# Altium schematic sheet Converter2.SchDoc
size Tabloid
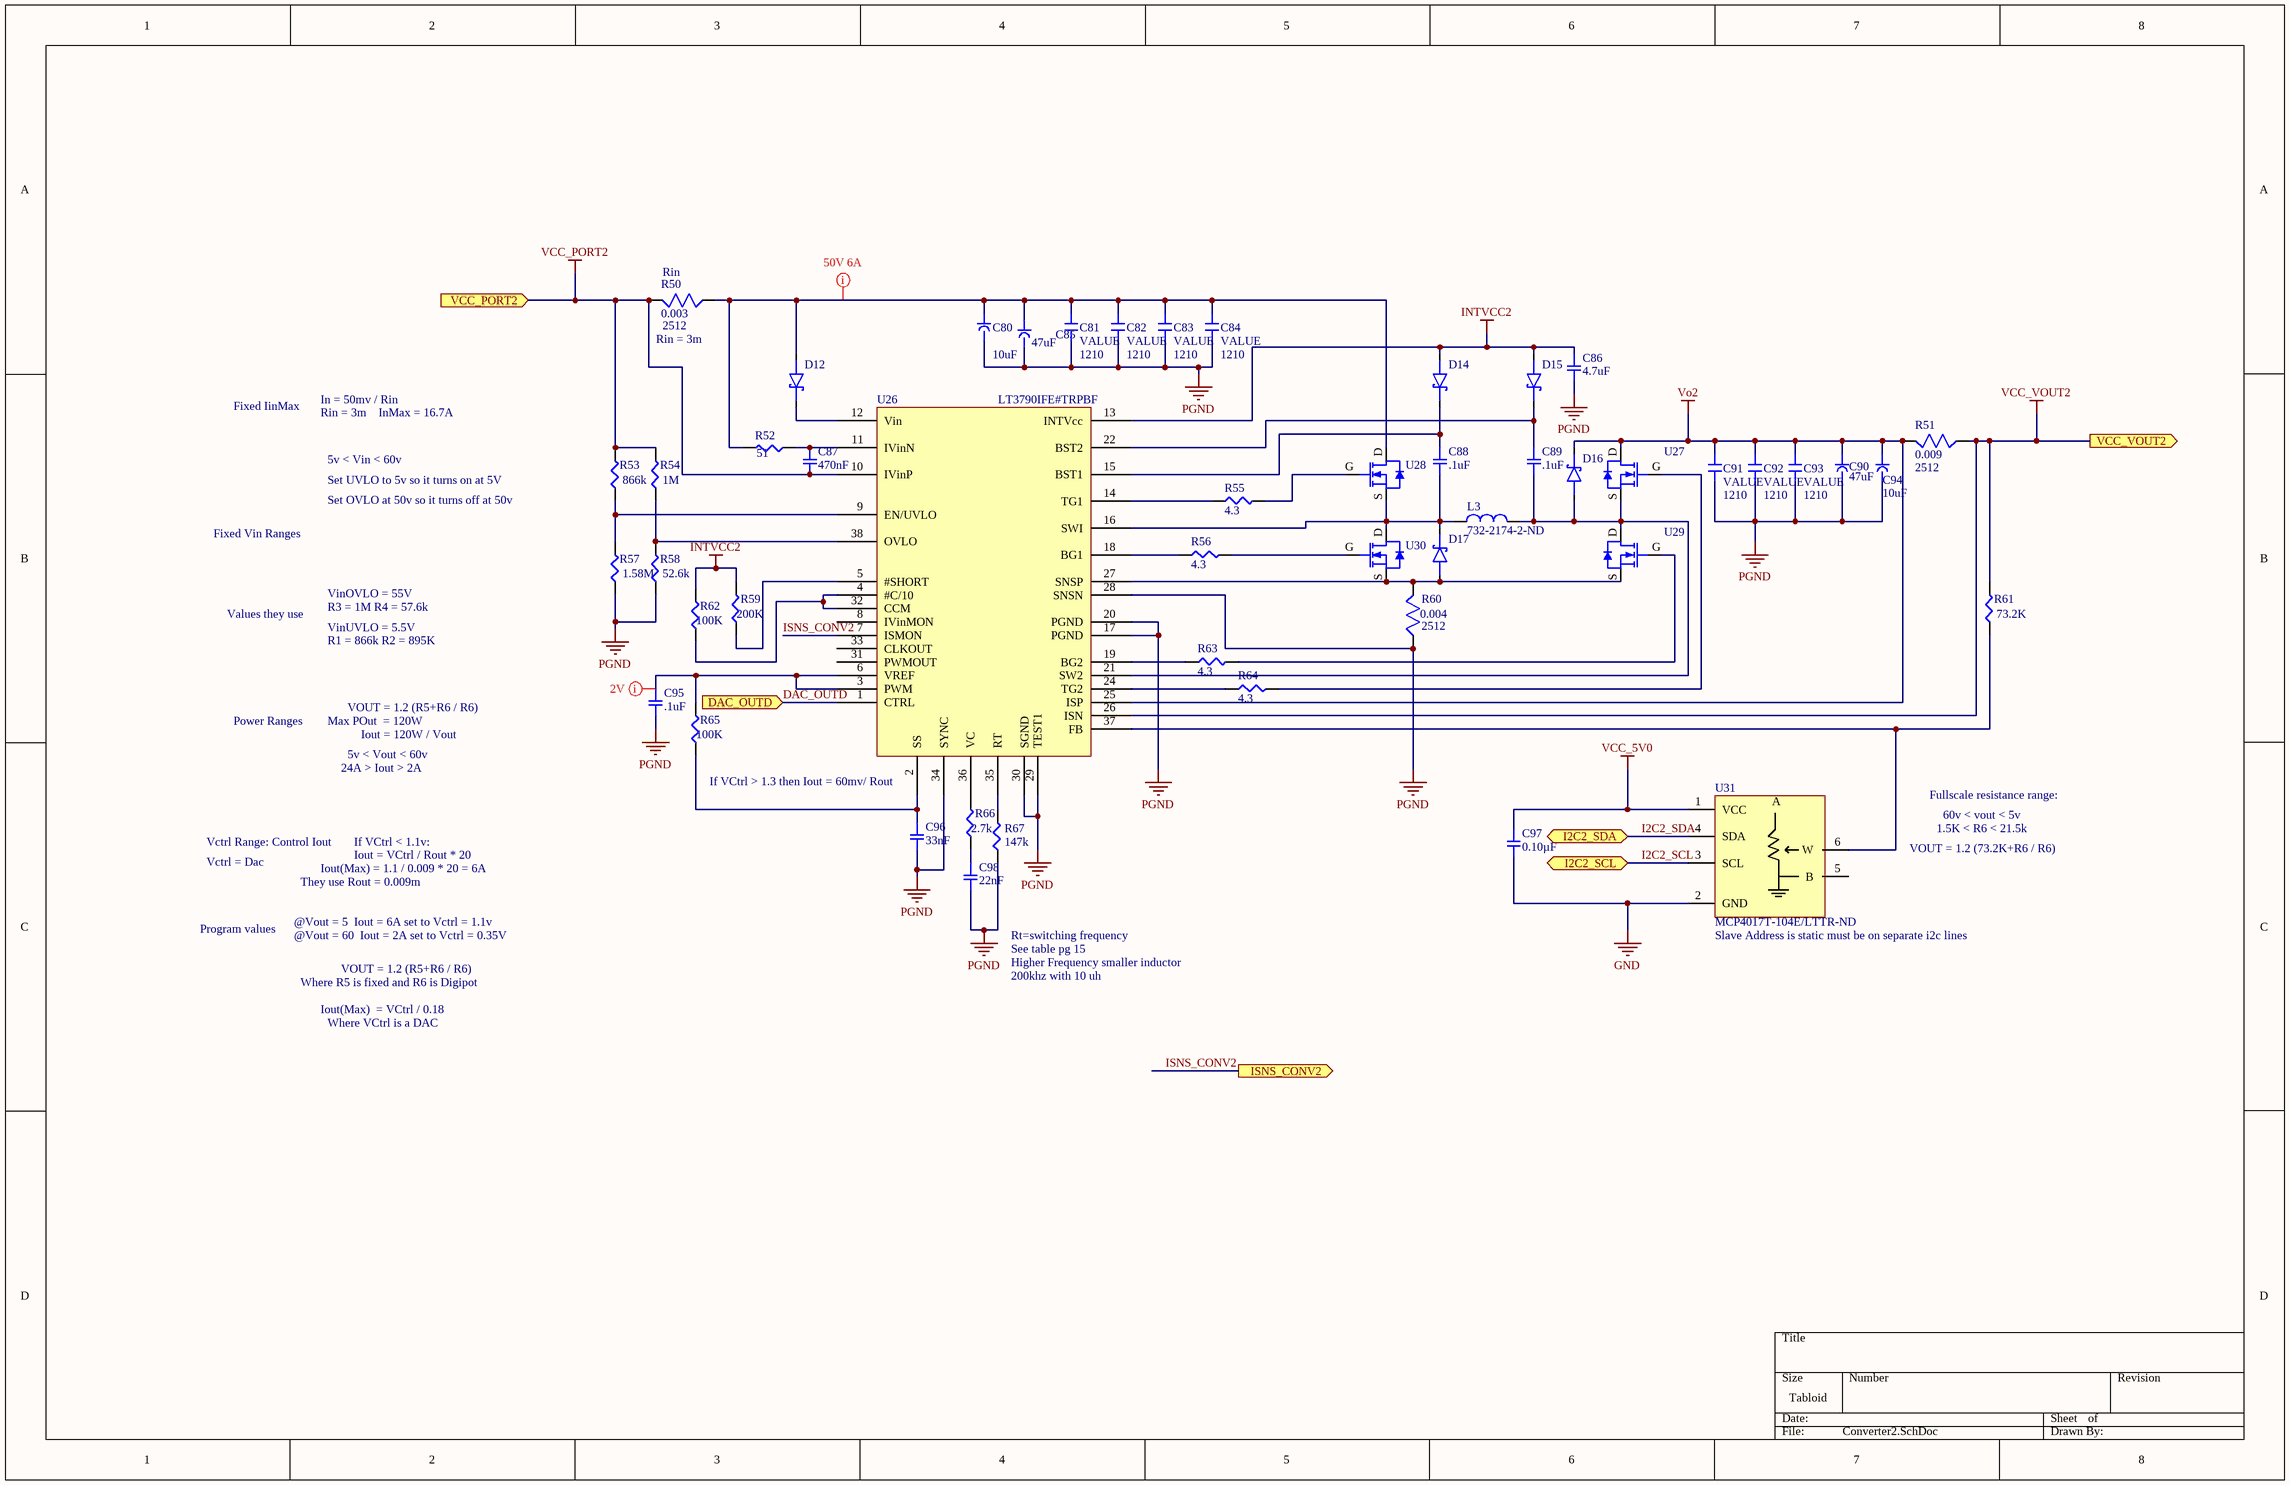
[diagram p0: Converter2.SchDoc]

## Parts
C80  value 10uF  [panasonic d8]  (hidden comment: EEE-FN1K100XL)
C81  VALUE  Size: 1210  [1210 cap]
C82  VALUE  Size: 1210  [1210 cap]
C83  VALUE  Size: 1210  [1210 cap]
C84  VALUE  Size: 1210  [1210 cap]
C85  10-EEE-FN1K470UVTR-ND  [EEE-FN1K470UV]  (value not drawn)
C86  4.7uF  [SMD-0603C]
C87  470nF  [SMD-0603C]
C88  .1uF  [SMD-0603C]
C89  .1uF  [SMD-0603C]
C90  10-EEE-FN1K470UVTR-ND  [EEE-FN1K470UV]  (value not drawn)
C91  VALUE  Size: 1210  [1210 cap]
C92  VALUE  Size: 1210  [1210 cap]
C93  VALUE  Size: 1210  [1210 cap]
C94  value 10uF  [panasonic d8]  (hidden comment: EEE-FN1K100XL)
C95  .1uF  [SMD-0603C]
C96  33nF  [SMD-0603C]
C97  0.10µF  [SMD-0603C]
C98  22nF  [SMD-0603C]
D12  SK58L-TPMSTR-ND  [SMC(DO-214AB)]  (value not drawn)
D14  BAT46WJ,115  [SOD323F]  (value not drawn)
D15  BAT46WJ,115  [SOD323F]  (value not drawn)
D16  SK58L-TPMSTR-ND  [SMC(DO-214AB)]  (value not drawn)
D17  SK58L-TPMSTR-ND  [SMC(DO-214AB)]  (value not drawn)
L3  732-2174-2-ND  [Inductor]
R50  0.003  [2512]
R51  0.009  [2512]
R52  51  [SMD-0603-RES]
R53  866k  [SMD-0603-RES]
R54  1M  [SMD-0603-RES]
R55  4.3  [SMD-0603-RES]
R56  4.3  [SMD-0603-RES]
R57  1.58M  [SMD-0603-RES]
R58  52.6k  [SMD-0603-RES]
R59  200K  [SMD-0603-RES]
R60  0.004  [2512]
R61  73.2K  [SMD-0603-RES]
R62  100K  [SMD-0603-RES]
R63  4.3  [SMD-0603-RES]
R64  4.3  [SMD-0603-RES]
R65  100K  [SMD-0603-RES]
R66  2.7k  [SMD-0603-RES]
R67  147k  [SMD-0603-RES]
U26  LT3790IFE#TRPBF  [TSSOP-38-GNDPAD]
U27  SQJA80EP-T1_GE3TR-ND  [PowerPAK® SO-8L SINGLE]  (value not drawn)
U28  SQJA80EP-T1_GE3TR-ND  [PowerPAK® SO-8L SINGLE]  (value not drawn)
U29  SQJA80EP-T1_GE3TR-ND  [PowerPAK® SO-8L SINGLE]  (value not drawn)
U30  SQJA80EP-T1_GE3TR-ND  [PowerPAK® SO-8L SINGLE]  (value not drawn)
U31  MCP4017T-104E/LTTR-ND  [SC70]

## Ports
DAC_OUTD (in), I2C2_SCL (bidir), I2C2_SDA (bidir), ISNS_CONV2 (out), VCC_PORT2 (in), VCC_VOUT2 (out)

## Nets
GND: C97.2 U31.2(GND)
INTVCC2: C86.1 D14.2 D15.2 R59.2 R62.2 U26.13(INTVcc)
PGND: C80.2 C81.2 C82.2 C83.2 C84.2 C85.1 C86.2 C90.1 C91.2 C92.2 C93.2 C94.2 C95.2 C96.2 C98.2 R57.1 R58.1 R60.1 R67.1 U26.17(PGND) U26.20(PGND) U26.28(SNSN) U26.29(TEST1) U26.30(SGND) U26.34(SYNC)
VCC_5V0: C97.1 U31.1(VCC)
VCC_PORT2: C87.2 R50.2 R53.2 R54.2 U26.10(IVinP) ; port VCC_PORT2
VCC_VOUT2: R51.1 R61.2 U26.26(ISN) ; port VCC_VOUT2
Vo2: C90.2 C91.1 C92.1 C93.1 C94.1 D16.1 R51.2 U26.25(ISP) U27.D(DRAIN)
DAC_OUTD: U26.1(CTRL) ; port DAC_OUTD
I2C2_SCL: U31.3(SCL) ; port I2C2_SCL
I2C2_SDA: U31.4(SDA) ; port I2C2_SDA
ISNS_CONV2: U26.7(ISMON) ; port ISNS_CONV2
NetC80_1: C80.1 C81.1 C82.1 C83.1 C84.1 C85.2 D12.2 R50.1 R52.2 U28.D(DRAIN)
NetC87_1: C87.1 R52.1 U26.11(IVinN)
NetC88_1: C88.1 D14.1 U26.15(BST1)
NetC88_2: C88.2 D17.1 L3.1 U26.16(SWI) U28.S(SOURCE) U30.D(DRAIN)
NetC89_1: C89.1 D15.1 U26.22(BST2)
NetC89_2: C89.2 D16.2 L3.2 U26.21(SW2) U27.S(SOURCE) U29.D(DRAIN)
NetC95_1: C95.1 R65.2 U26.3(PWM) U26.6(VREF)
NetC96_1: C96.1 R65.1 U26.2(SS)
NetC98_1: C98.1 R66.1
NetD12_1: D12.1 U26.12(Vin)
NetD17_2: D17.2 R60.2 U26.27(SNSP) U29.S(SOURCE) U30.S(SOURCE)
NetR53_1: R53.1 R57.2 U26.9(EN/UVLO)
NetR54_1: R54.1 R58.2 U26.38(OVLO)
NetR55_1: R55.1 U26.14(TG1)
NetR55_2: R55.2 U28.G(GATE)
NetR56_1: R56.1 U26.18(BG1)
NetR56_2: R56.2 U30.G(GATE)
NetR59_1: R59.1 U26.5(#SHORT)
NetR61_1: R61.1 U26.37(FB) U31.6(W)
NetR62_1: R62.1 U26.4(#C/10) U26.32(CCM)
NetR63_1: R63.1 U26.19(BG2)
NetR63_2: R63.2 U29.G(GATE)
NetR64_1: R64.1 U26.24(TG2)
NetR64_2: R64.2 U27.G(GATE)
NetR66_2: R66.2 U26.36(VC)
NetR67_2: R67.2 U26.35(RT)

Not connected (* = marked no-connect by the designer): U26 8(IVinMON) 31(PWMOUT) 33(CLKOUT); U31 5(B)

## Layout directives
mark named 2V: NetC95_1
mark named 50V 6A: NetC80_1

## Notes on the sheet
- (near R50) Rin
- (near R50) Rin = 3m
- Fixed IinMax
- Rin = 3m    InMax = 16.7A
- In = 50mv / Rin
- Set UVLO to 5v so it turns on at 5V
- 5v < Vin < 60v
- Fixed Vin Ranges
- Set OVLO at 50v so it turns off at 50v
- Values they use
- VinOVLO = 55V
- R3 = 1M R4 = 57.6k
- VinUVLO = 5.5V
- R1 = 866k R2 = 895K
- Power Ranges
- Max POut  = 120W
- 5v < Vout < 60v
- VOUT = 1.2 (R5+R6 / R6)
- Iout = 120W / Vout
- 24A > Iout > 2A
- If VCtrl > 1.3 then Iout = 60mv/ Rout
- Fullscale resistance range:
- 1.5K < R6 < 21.5k
- 60v < vout < 5v
- Vctrl Range: Control Iout
- Vctrl = Dac
- They use Rout = 0.009m
- Iout(Max) = 1.1 / 0.009 * 20 = 6A
- If VCtrl < 1.1v:
- Iout = VCtrl / Rout * 20
- VOUT = 1.2 (73.2K+R6 / R6)
- Program values
- @Vout = 5  Iout = 6A set to Vctrl = 1.1v
- @Vout = 60  Iout = 2A set to Vctrl = 0.35V
- Rt=switching frequency
- See table pg 15
- Higher Frequency smaller inductor
- (near U31) Slave Address is static must be on separate i2c lines
- Where R5 is fixed and R6 is Digipot
- Iout(Max)  = VCtrl / 0.18
- Where VCtrl is a DAC
- 200khz with 10 uh
- (in symbol CAP ALUM 47UF) 47uF
- (in symbol IC DIGIPOT MCP4017T-104E/LT) A

## Library data of the parts
C80 C94 = CAP ALUM 10UF: CAP ALUM 10UF 20% 80V SMD
C81-C84 C91-C93 = CAP SMD 1210
C85 C90 = CAP ALUM 47UF: CAP ALUM 47UF 20% 80V SMD
C86-C89 C95 C96 C98 = GCJ188R71H472KA01D: 0603; Manufacturer: Murata Electronics North America; Factory Stock: 0; Unit Price (USD): 0.19; Minimum Quantity: 1; Value: 4700pF; Tolerance: ±10%; Voltage: 50V; Temperature Coefficient: X7R; Datasheets: http://www.murata.com/~/media/webrenewal/support/library/catalog/products/capacitor/mlcc/c03e.ashx; Image: //media.digikey.com/Renders/Murata%20Renders/0603%28LQG18%29.jpg; Digi-Key Part Number: 490-5764-1-ND; Part Number: GCJ188R71H472KA01D; Quantity Available: 7743; @ qty: 0; Packaging: Cut Tape (CT); Series: GCJ; Part Status: Active; Operating Temperature: -55°C ~ 125°C; Features: Soft Termination; Ratings: AEC-Q200; Applications: Automotive, Boardflex Sensitive; Mounting Type: Surface Mount, MLCC; Package / Case: 0603 (1608 Metric); Size / Dimension: 0.063" L x 0.031" W (1.60mm x 0.80mm); Height - Seated (Max): -; Thickness (Max): 0.031" (0.80mm); Lead Spacing: -; Lead Style: -
C97 = GCJ188R71H104KA12D: CAP CER 0.1UF 50V X7R 0603; Manufacturer: Murata Electronics North America; Factory Stock: 0; Unit Price (USD): 0.12; Minimum Quantity: 1; Tolerance: ±10%; Datasheets: http://www.murata.com/~/media/webrenewal/support/library/catalog/products/capacitor/mlcc/c03e.ashx; Image: //media.digikey.com/Renders/Murata%20Renders/0603%28LQG18%29.jpg; Digi-Key Part Number: 490-5798-1-ND; Part Number: GCJ188R71H104KA12D; Quantity Available: 163695; @ qty: 0; Packaging: Cut Tape (CT); Series: GCJ; Part Status: Active; Value: 0.10µF; Voltage: 50V; Temperature Coefficient: X7R; Operating Temperature: -55°C ~ 125°C; Features: Soft Termination; Ratings: AEC-Q200; Applications: Automotive, Boardflex Sensitive; Mounting Type: Surface Mount, MLCC; Package / Case: 0603 (1608 Metric); Size / Dimension: 0.063" L x 0.031" W (1.60mm x 0.80mm); Height - Seated (Max): -; Thickness (Max): 0.035" (0.90mm); Lead Spacing: -; Lead Style: -
D12 D16 D17 = DIODE SK58L-TP: DIODE SCHOTTKY 80V 5A DO214AB/SMC / Diode Schottky 80 V 5A Surface Mount SMC (DO-214AB)
D14 D15 = BAT46WJ,115: DIODE SCHOTTKY 100V 250MA SOD323 / Diode Schottky 100 V 250mA (DC) Surface Mount SOD-323F; Mfr_Name: Nexperia; Type: DEV; Copyright: Copyright (C) 2021 Ultra Librarian. All rights reserved.; Manufacturer_Part_Number: BAT46WJ,115; Digi-Key_Part_Number_1: 1727-4817-2-ND; Digi-Key_Part_Number_2: 1727-4817-1-ND; Digi-Key_Part_Number_3: 1727-4817-6-ND; RefDes: RefDes
L3 = INDUCTOR 7443556680: FIXED IND 6.8UH 18.5A 4.1MOHM SM
R50 R51 R60 = RES SMD 2512: RES SMD 2512 2W; Size: 2512
R52-R54 R57-R59 R61 R62 R65-R67 = ERJ-3BQJ5R6V: 0603; Manufacturer: Panasonic Electronic Components; Factory Stock: 0; Unit Price (USD): 0.03980; @ qty: 1500; Minimum Quantity: 1; Value: 5.6; Tolerance: ±5%; Power (Watts): 0.25W, 1/4W; Temperature Coefficient: ±200ppm/°C; Part Number: ERJ-3BQJ5R6V; Datasheets: https://industrial.panasonic.com/cdbs/www-data/pdf/RDA0000/AOA0000C239.pdf; Image: //media.digikey.com/Photos/Panasonic%20Photos/MFG_ERJ-P6W%20Series.jpg; Digi-Key Part Number: P17425CT-ND; Quantity Available: 3950; Packaging: Cut Tape (CT); Series: ERJ; Part Status: Active; Composition: Thick Film; Features: Automotive AEC-Q200, Current Sense; Operating Temperature: -55°C ~ 125°C; Package / Case: 0603 (1608 Metric); Supplier Device Package: 0603; Size / Dimension: 0.063" L x 0.031" W (1.60mm x 0.80mm); Height - Seated (Max): 0.022" (0.55mm); Number of Terminations: 2; Failure Rate: -
R55 R56 R63 R64 = ERJ-3BQF1R0V: RES SMD 1 OHM 1% 1/4W 0603; Manufacturer: Panasonic Electronic Components; Factory Stock: 0; Unit Price (USD): 0.05386; @ qty: 1500; Minimum Quantity: 1; Value: 1; Power (Watts): 0.25W, 1/4W; Temperature Coefficient: ±200ppm/°C; Part Number: ERJ-3BQF1R0V; Datasheets: https://industrial.panasonic.com/cdbs/www-data/pdf/RDA0000/AOA0000C239.pdf; Image: //media.digikey.com/Photos/Panasonic%20Photos/MFG_ERJ-P6W%20Series.jpg; Digi-Key Part Number: P17371CT-ND; Quantity Available: 30514; Packaging: Cut Tape (CT); Series: ERJ; Part Status: Active; Tolerance: ±1%; Composition: Thick Film; Features: Automotive AEC-Q200, Current Sense; Operating Temperature: -55°C ~ 125°C; Package / Case: 0603 (1608 Metric); Supplier Device Package: 0603; Size / Dimension: 0.063" L x 0.031" W (1.60mm x 0.80mm); Height - Seated (Max): 0.022" (0.55mm); Number of Terminations: 2; Failure Rate: -
U26 = IC LT3790 BUCK/BOOST 60V 150W: IC REG CTRLR BUCK-BOOST 38TSSOP / Buck-Boost Regulator Positive Output Step-Up/Step-Down - DC-DC Controller IC 38-TSSOP-EP
U27-U30 = FET SQJA80EP-T1_GE3: MOSFET N-CH 80V 60A PPAK SO-8
U31 = IC DIGIPOT MCP4017T-104E/LT: IC DGT POT 100KOHM 128TAP SC70-6